# Altium project ZASS_MANTIS.PrjPcb
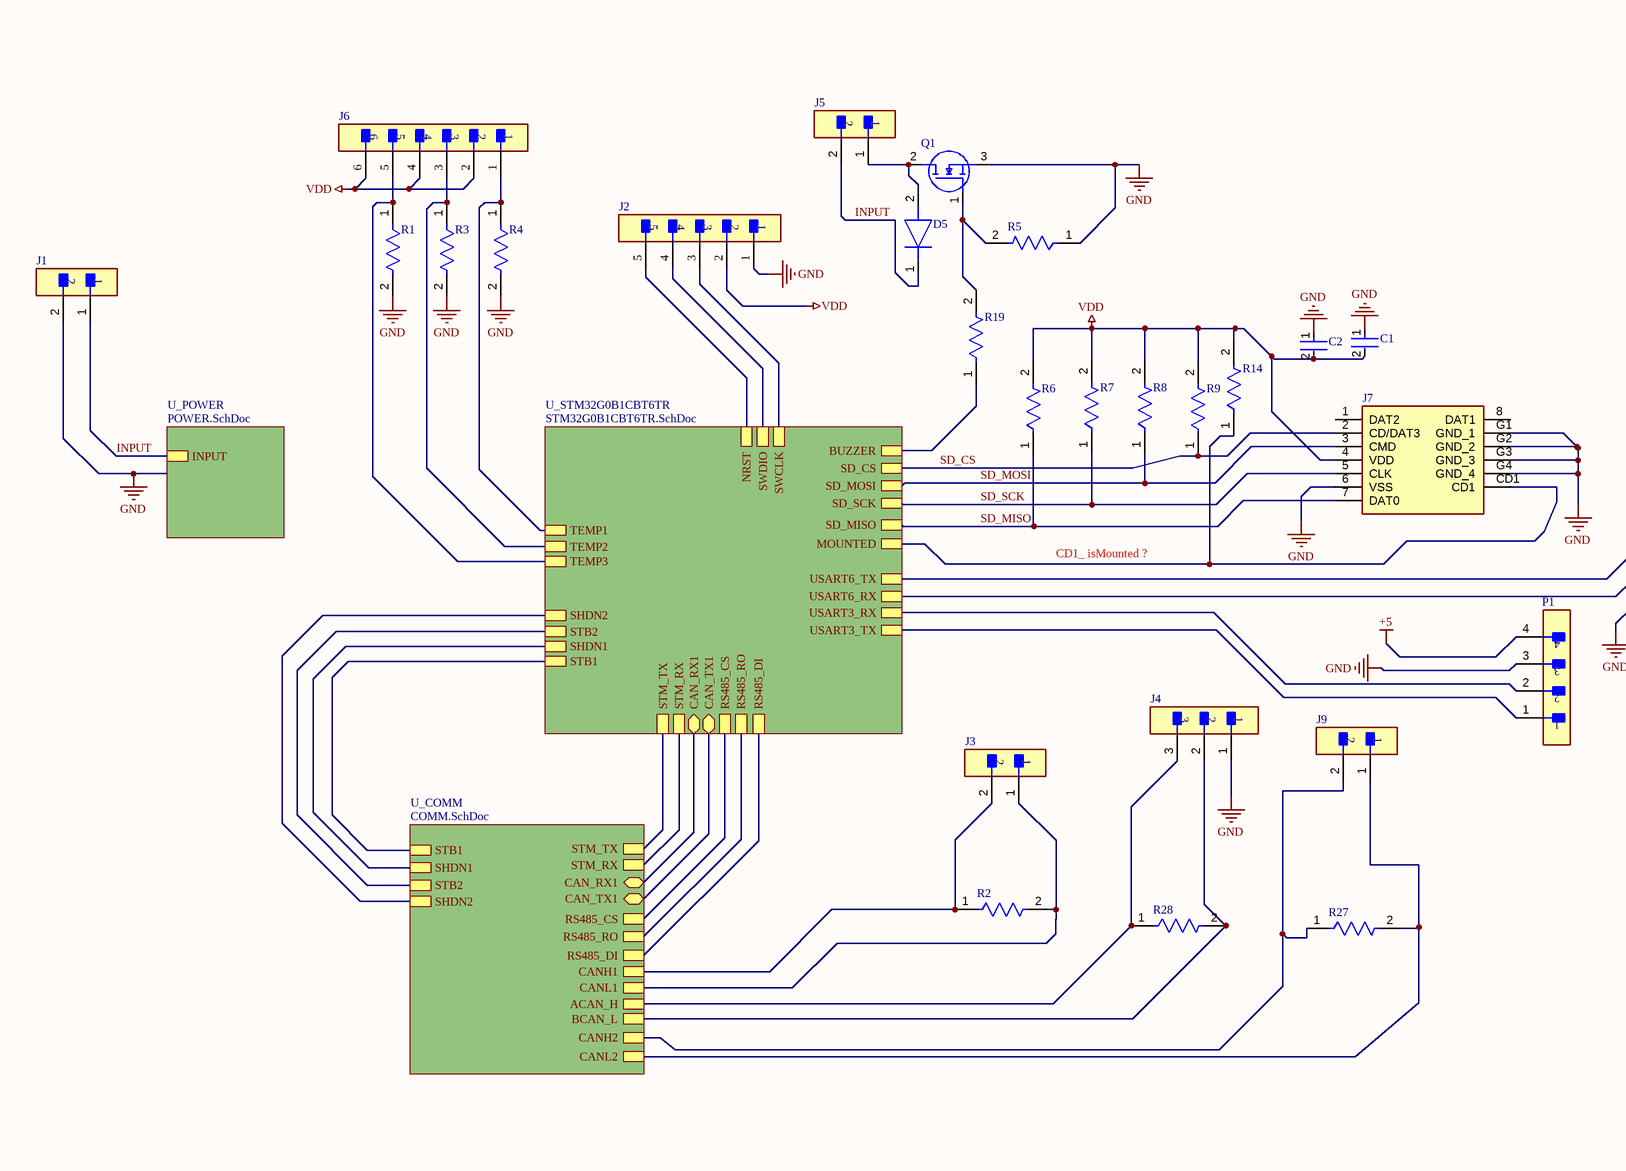
[diagram p0: MAIN.SchDoc, left]
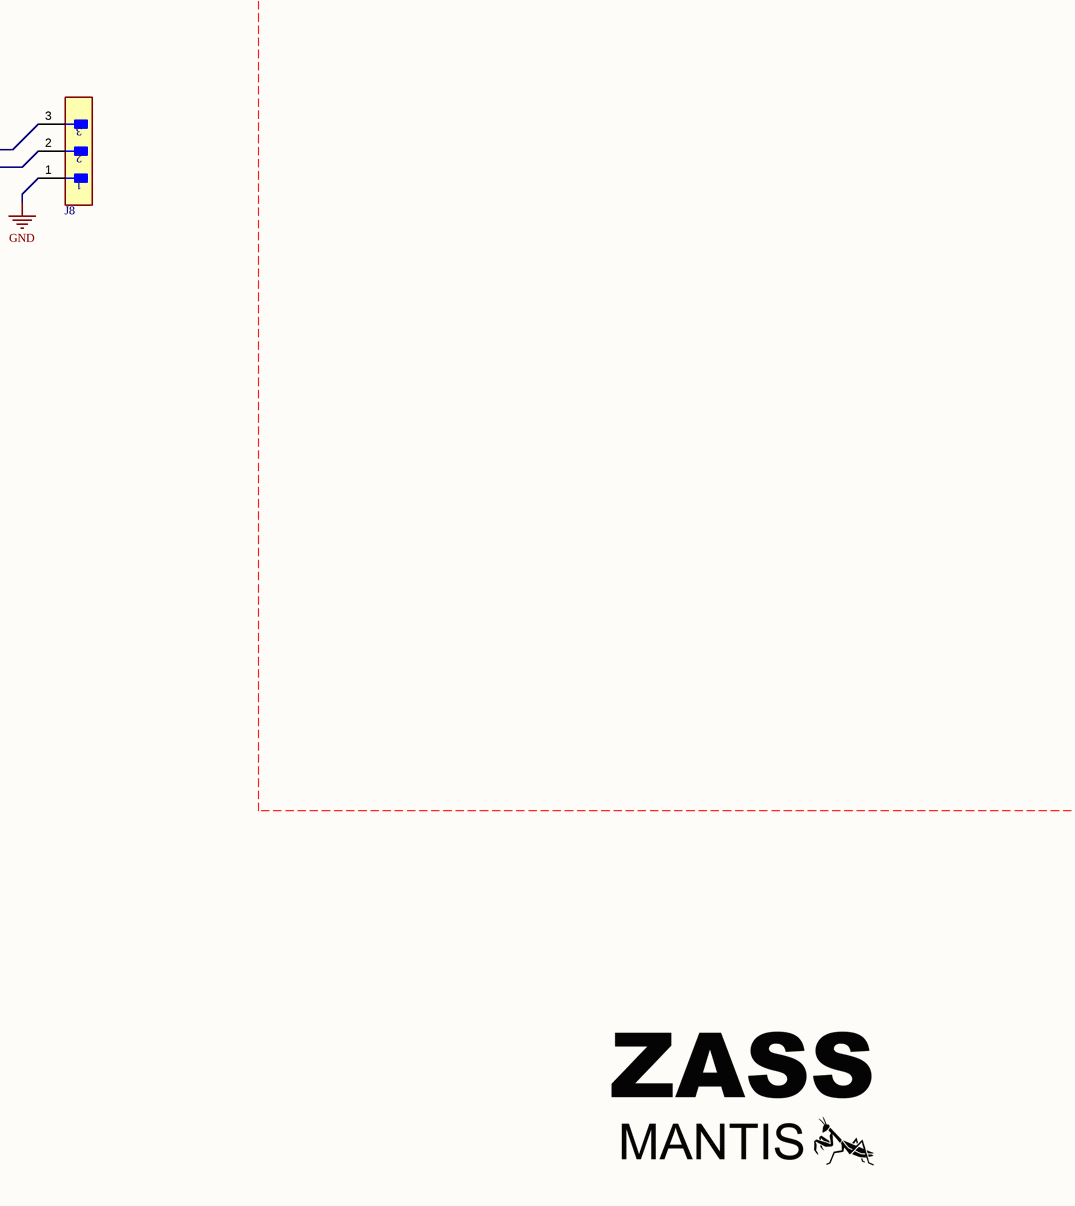
[diagram p1: MAIN.SchDoc, right]
3 sheets, 57 parts. Net scope: hierarchical (ports join the sheet entries above them; power ports are global).
Board files: PCB2.PcbDoc, PCB1.PcbDoc
Sheets:
  MAIN.SchDoc
    U_STM32G0B1CBT6TR = STM32G0B1CBT6TR.SchDoc
    U_COMM = COMM.SchDoc

## Sheet MAIN.SchDoc
size 594 x 420 mm; SheetNumber: 1; SheetTotal: 4

### Parts
C1  CC0805KRX7R5BB104  [FP-CC0805-EA-MFG]  (value not drawn)
C2  CC0805KRX7R5BB104  [FP-CC0805-EA-MFG]  (value not drawn)
D5  1N4007WS  [SOD2613X110N]  (value not drawn)
J1  B2B-XH-A(LF)(SN)  [FP-B2B-XH-A_LF_SN-MFG]  (value not drawn)
J2  B5B-XH-AM(LF)(SN)  [FP-B5B-XH-AM_LF_SN-MFG]  (value not drawn)
J3  B2B-XH-A(LF)(SN)  [FP-B2B-XH-A_LF_SN-MFG]  (value not drawn)
J4  B3B-XH-A(LF)(SN)  [FP-B3B-XH-A_LF_SN-MFG]  (value not drawn)
J5  S2B-XH-A(LF)(SN)  [FP-B2B-XH-A_LF_SN-MFG]  (value not drawn)
J6  B6B-XH-AM(LF)(SN)  [FP-B6B-XH-AM_LF_SN-MFG]  (value not drawn)
J7  MSD-4-A  [MSD4A]  (value not drawn)
J8  B3B-XH-A(LF)(SN)  [FP-B3B-XH-A_LF_SN-MFG]  (value not drawn)
J9  B2B-XH-A(LF)(SN)  [FP-B2B-XH-A_LF_SN-MFG]  (value not drawn)
P1  B4B-XH-A(LF)(SN)  [FP-B4B-XH-A_LF_SN-MFG]  (value not drawn)
Q1  AO3422  [SOT95P237X112-3N]  (value not drawn)
R1  CRGCQ0603J10K  [FP-CRGCQ0603-IPC_C]  (value not drawn)
R2  CRGCQ0603F120R  [FP-CRGCQ0603-IPC_C]  (value not drawn)
R3  CRGCQ0603J10K  [FP-CRGCQ0603-IPC_C]  (value not drawn)
R4  CRGCQ0603J10K  [FP-CRGCQ0603-IPC_C]  (value not drawn)
R5  CRGCQ0603J10K  [FP-CRGCQ0603-IPC_C]  (value not drawn)
R6  CRCW06034K70FKEA  [FP-CRCW0603-e3-IPC_A]  (value not drawn)
R7  CRCW06034K70FKEA  [FP-CRCW0603-e3-IPC_A]  (value not drawn)
R8  CRCW06034K70FKEA  [FP-CRCW0603-e3-IPC_A]  (value not drawn)
R9  CRCW06034K70FKEA  [FP-CRCW0603-e3-IPC_A]  (value not drawn)
R14  CRCW06034K70FKEA  [FP-CRCW0603-e3-IPC_A]  (value not drawn)
R19  CRGCQ0603F1K2  [FP-CRGCQ0603-IPC_C]  (value not drawn)
R27  CRGCQ0603F120R  [FP-CRGCQ0603-IPC_C]  (value not drawn)
R28  CRGCQ0603F120R  [FP-CRGCQ0603-IPC_C]  (value not drawn)

### Sub-sheets
U_COMM = COMM.SchDoc: CAN_TX1 (bidir), CAN_RX1 (bidir), ACAN_H, BCAN_L, STM_RX, STM_TX, RS485_CS, CANH1, CANL1, STB1, SHDN1, STB2, SHDN2, CANL2, CANH2, RS485_DI, RS485_RO
U_POWER = POWER.SchDoc (file not in this document): INPUT
U_STM32G0B1CBT6TR = STM32G0B1CBT6TR.SchDoc: CAN_RX1 (bidir), CAN_TX1 (bidir), STM_TX, STM_RX, USART3_RX, USART3_TX, TEMP1, TEMP2, TEMP3, SD_CS, SD_SCK, SD_MISO, SD_MOSI, BUZZER, RS485_CS, NRST, SWCLK, SWDIO, STB1, SHDN1, STB2, SHDN2, MOUNTED, RS485_DI, RS485_RO, USART6_RX, USART6_TX

### Nets
+5: P1.4
GND: C1.1 C2.1 J1.2 J2.1 J4.1 J7.6(VSS) J7.G1(GND_1) J7.G2(GND_2) J7.G3(GND_3) J7.G4(GND_4) J8.1 P1.3 Q1.3(S) R1.2 R3.2 R4.2 R5.1
VDD: C1.2 C2.2 J2.2 J6.2 J6.4 J6.6 J7.4(VDD) R6.2 R7.2 R8.2 R9.2 R14.2
INPUT: D5.1(K) J1.1 J5.2 ; sheet U_POWER/INPUT
NRST: J2.5 ; sheet U_STM32G0B1CBT6TR/NRST
SD_CS: J7.2(CD/DAT3) R9.1 ; sheet U_STM32G0B1CBT6TR/SD_CS
SD_MISO: J7.7(DAT0) R6.1 ; sheet U_STM32G0B1CBT6TR/SD_MISO
SD_MOSI: J7.3(CMD) R8.1 ; sheet U_STM32G0B1CBT6TR/SD_MOSI
SD_SCK: J7.5(CLK) R7.1 ; sheet U_STM32G0B1CBT6TR/SD_SCK
SHDN1: sheet U_STM32G0B1CBT6TR/SHDN1, sheet U_COMM/SHDN1
SHDN2: sheet U_STM32G0B1CBT6TR/SHDN2, sheet U_COMM/SHDN2
STB1: sheet U_STM32G0B1CBT6TR/STB1, sheet U_COMM/STB1
STB2: sheet U_STM32G0B1CBT6TR/STB2, sheet U_COMM/STB2
SWCLK: J2.3 ; sheet U_STM32G0B1CBT6TR/SWCLK
SWDIO: J2.4 ; sheet U_STM32G0B1CBT6TR/SWDIO
NetD2_1: J3.2 R2.1 ; sheet U_COMM/CANH1
NetD2_2: J3.1 R2.2 ; sheet U_COMM/CANL1
NetD4_1: J9.2 R27.1 ; sheet U_COMM/CANH2
NetD4_2: J9.1 R27.2 ; sheet U_COMM/CANL2
NetD5_2: D5.2(A) J5.1 Q1.2(D)
NetIC1_11: J6.1 R4.1 ; sheet U_STM32G0B1CBT6TR/TEMP1
NetIC1_12: J6.3 R3.1 ; sheet U_STM32G0B1CBT6TR/TEMP2
NetIC1_13: J6.5 R1.1 ; sheet U_STM32G0B1CBT6TR/TEMP3
NetIC1_14: J7.CD1 R14.1 ; sheet U_STM32G0B1CBT6TR/MOUNTED
NetIC1_19: sheet U_STM32G0B1CBT6TR/STM_RX, sheet U_COMM/STM_RX
NetIC1_20: sheet U_STM32G0B1CBT6TR/STM_TX, sheet U_COMM/STM_TX
NetIC1_21: R19.1 ; sheet U_STM32G0B1CBT6TR/BUZZER
NetIC1_22: P1.1 ; sheet U_STM32G0B1CBT6TR/USART3_TX
NetIC1_23: P1.2 ; sheet U_STM32G0B1CBT6TR/USART3_RX
NetIC1_29: sheet U_STM32G0B1CBT6TR/RS485_CS, sheet U_COMM/RS485_CS
NetIC1_33: sheet U_STM32G0B1CBT6TR/CAN_RX1, sheet U_COMM/CAN_RX1
NetIC1_34: sheet U_STM32G0B1CBT6TR/CAN_TX1, sheet U_COMM/CAN_TX1
NetIC1_40: sheet U_STM32G0B1CBT6TR/RS485_DI, sheet U_COMM/RS485_DI
NetIC1_41: sheet U_STM32G0B1CBT6TR/RS485_RO, sheet U_COMM/RS485_RO
NetIC1_47: J8.2 ; sheet U_STM32G0B1CBT6TR/USART6_RX
NetIC1_48: J8.3 ; sheet U_STM32G0B1CBT6TR/USART6_TX
NetJ4_2: J4.2 R28.2 ; sheet U_COMM/BCAN_L
NetJ4_3: J4.3 R28.1 ; sheet U_COMM/ACAN_H
NetQ1_1: Q1.1(G) R5.2 R19.2

Not connected (* = marked no-connect by the designer): J7 1(DAT2) 8(DAT1)

### Notes on the sheet
- CD1_ isMounted ?
- DWG NO:
- REV:
- THIS DOCUMENT AND THE DATA DISCLOSED HEREIN OR
- HEREWITH IS THE PROPERTY OF ALTIUM LIMITED AND MAY
- BE FREELY DISTRIBUTED IN WHOLE. NO RIGHTS ARE
- RESERVED OR EXPRESS OR IMPLIED WARANTEE GIVEN.
- REVISION
- DESCRIPTION
- DATE
- APPROVED
- PROJECT
- PROJECT REVISION:
- TITLE
- A2
- SIZE
- FILE NAME
- SHEET
- OF

### Library data of the parts
C1 C2 = CMP-03422-000810-2: CAP CER X7R 0805; RoHS Compliant: Yes
D5 = 1N4007WS: Diode; Manufacturer_Name: MDD; Datasheet Link: https://datasheet.lcsc.com/szlcsc/MDD-Jiangsu-Yutai-Elec-1N4007WS_C193404.pdf; Height: 1.1mm; Manufacturer_Part_Number: 1N4007WS
J1 J3 J5 J9 = CMP-2000-05888-3: CONN HEADER VERT 2POS 2.5MM; Current Rating: 3A; Voltage Rating: 250V; Number of Contacts: 2; Contact Resistance: 20mR; Wire/Cable Gauge: 22AWG; Insulation Resistance: 1GR; Connector Type: Male Pin; Packaging: Bulk; Contact Material: Brass; Lead Free: Lead Free; Orientation: Straight; Contact Plating: Tin; Max Current Rating: 3A; Termination: Solder; Fastening Type: Detent; Depth: 5.75mm; Housing Material: Polyamide; REACH SVHC: No SVHC; Series: XH; Voltage Rating (AC): 250V; Number of Positions: 2; Color: Natural; Contact Type: Male Pin; Max Voltage Rating (DC): 250V; Pitch: 2.5mm; Lead Pitch: 2.5mm; Mount: Through Hole; Max Operating Temperature: 85°C; Length: 7.4mm; Max Voltage Rating (AC): 250V; Min Operating Temperature: -25°C; Number of Rows: 1; Housing Color: White
J2 = CMP-17439-000304-1: CONN HEADER VERT 5POS 2.5MM; Mated Stacking Heights: 9.8mm; Voltage Rating: 250V; Max Current Rating: 3A; Number of Positions: 5; Contact Resistance: 20mR; Depth: 5.75mm; Connector Type: Header; Color: Green; Insulation Material: Nylon; Contact Plating: Copper; Length: 14.9mm; Fastening Type: Detent; Contact Material: Brass; Number of Rows: 1; Contact Type: Male Pin; Housing Material: Polyamide; Housing Color: White; Lead Free: Lead Free; Max Voltage Rating (AC): 250V; Mount: Through Hole; Contact Shape: Square; Min Operating Temperature: -25°C; Packaging: Bulk; Orientation: Straight; Insulation Color: Natural; Series: XH; Flammability Rating: UL94 V-0; Contact Finish - Mating: TIN; Max Operating Temperature: 85°C; Termination: Solder; Pitch: 2.5mm
J4 J8 = CMP-17439-000014-3: CONN HEADER VERT 3POS 2.5MM; Max Voltage Rating (DC): 250V; Number of Positions: 3; Current Rating: 3A; Gender: Male; Wire/Cable Gauge: 22AWG; Contact Resistance: 20mR; Insulation Resistance: 1GR; Insulation Material: Nylon; Contact Plating: Tin; Depth: 5.75mm; Contact Type: Male Pin; Max Operating Temperature: 85°C; Insulation Color: Natural; Voltage Rating (AC): 250V; Color: Natural; Connector Type: Header; Orientation: Straight; Fastening Type: Detent; Housing Color: White; Min Operating Temperature: -25°C; Termination: Solder; Voltage Rating: 250V; Series: XH; Pitch: 2.5mm; Contact Shape: Square; Number of Rows: 1; Lead Free: Lead Free; Packaging: Bulk; Mount: Through Hole; Flammability Rating: UL94 V-0; Max Voltage Rating (AC): 250V; REACH SVHC: No SVHC; Housing Material: Polyamide; Contact Material: Brass; Lead Pitch: 2.5mm; Contact Finish - Mating: TIN; Length: 9.9mm; Max Current Rating: 3A; Number of Contacts: 3
J6 = CMP-17439-000167-1: CONN HEADER VERT 6POS 2.5MM; Shape: Straight; Current Rating: 3A; Mated Stacking Heights: 9.8mm; Number of Positions: 6; Voltage Rating: 250V; Pitch: 2.5mm; Insulation Color: Natural; Number of Pins: 6; Width: 5.75mm; Flammability Rating: UL94 V-0; Packaging: Bulk; Connector Type: Header; Number of Rows: 1; Contact Plating: Copper; Mount: Through Hole; Min Operating Temperature: -25°C; Contact Type: Male Pin; Contact Shape: Square; Fastening Type: Detent; Length: 17.4mm; Series: XH; Contact Finish - Mating: TIN; Max Operating Temperature: 85°C; Insulation Material: Nylon; Number of Poles: 6; Termination: Press-Fit; Contact Material: Brass; Height: 7mm
J7 = MSD-4-A: Connector; Manufacturer_Name: Same Sky; Datasheet Link: https://www.sameskydevices.com/product/resource/MSD-4-A.pdf; Height: 2mm; Manufacturer_Part_Number: MSD-4-A; Mouser Part Number: 179-MSD-4-A; Mouser Price/Stock: https://www.mouser.co.uk/ProductDetail/Same-Sky/MSD-4-A?qs=Z%252BL2brAPG1Jll%252BQTi%252Btupg%3D%3D; Arrow Part Number: MSD-4-A; Arrow Price/Stock: https://www.arrow.com/en/products/msd-4-a/cui-devices?utm_currency=USD&region=nac
P1 = CMP-17439-000250-1: CONN HEADER VERT 4POS 2.5MM; Number of Contacts: 4; Contact Resistance: 20mR; Voltage Rating: 250V; Max Current Rating: 3A; Gender: Male; Wire/Cable Gauge: 22AWG; Mated Stacking Heights: 9.8mm; Insulation Resistance: 1GR; Orientation: Straight; Contact Type: Male Pin; Contact Finish - Mating: TIN; Series: XH; Max Voltage Rating (AC): 250V; Lead Pitch: 2.5mm; Contact Shape: Square; Insulation Color: Natural; Termination: Solder; Lead Free: Lead Free; Voltage Rating (AC): 250V; Number of Rows: 1; Flammability Rating: UL94 V-0; Number of Positions: 4; Max Operating Temperature: 85°C; Package Quantity: 500; Mount: Through Hole; REACH SVHC: No SVHC; Connector Type: Header; Insulation Material: Nylon; Fastening Type: Detent; Min Operating Temperature: -25°C; Housing Color: White; Packaging: Bulk; Contact Plating: Tin; Contact Material: Brass; Max Voltage Rating (DC): 250V; Housing Material: Polyamide; Color: Natural; Material: Polyamide; Pitch: 2.5mm; Depth: 5.75mm; Current Rating: 3A; Length: 12.4mm
Q1 = AO3422: MOSFET (N-Channel); Manufacturer_Name: Alpha & Omega Semiconductors; Datasheet Link: http://aosmd.com/res/data_sheets/AO3422.pdf; Height: 1.12mm; Manufacturer_Part_Number: AO3422; Arrow Part Number: AO3422; Arrow Price/Stock: https://www.arrow.com/en/products/ao3422/alpha-and-omega-semiconductor?region=nac
R1 R3-R5 = CMP-03211-009884-1: CRGCQ 0603 10K 5%; Manufacturer: TE Connectivity; Tolerance: 0.05; Power Rating: 0.1W; Resistance: 10KΩ; Voltage Rating: 75V; Value: 10KΩ; Temperature Coefficient: ±100ppm/°C; Composition: Thick Film; ComponentLink2URL: https://www.te.com/commerce/DocumentDelivery/DDEController?Action=showdoc&DocId=Data+Sheet%7F1773204-3%7F1%7Fpdf%7FEnglish%7FENG_DS_1773204-3_1.pdf%7F4-2176339-923; Device Class L1: Passive Components; Package: CRGCQ0603; Mouser Description: Res Thick Film 0603 10K Ohm 5% 0.1W(1/10W) ±100ppm/C Pad SMD Automotive T/R; Temperature Range High: +155°C; Category: Res; Device Class L2: Resistors; Height: 0.55mm; RoHS: TRUE; Lead Free: Yes; Ipc Land Pattern Name: RESC16080X45; Temperature: -55°C to +155°C; Series: CRGCQ; Digikey Description: CRGCQ 0603 10K 5%; Octopart: https://octopart.com/crgcq0603j10k-te+connectivity-91018097; Device Class L3: Chip SMD Resistors; Ambient Temperature Range High: +70°C; ComponentLink2Description: Datasheet; Temperature Range Low: -55°C; Manufacturer Part Number: CRGCQ0603J10K
R2 R27 R28 = CMP-03211-001601-1: CRGCQ0603 120Ω 1% ±100ppm/°C 75V; Manufacturer: TE Connectivity; Tolerance: 0.01; Power Rating: 0.1W; Voltage Rating: 75V; Device Class L2: Resistors; Ambient Temperature Range High: +70°C; Mouser Description: Res, Aec-Q200, Thick Film, 120R, 1%, 0603; Composition: Thick Film; Device Class L1: Passive Components; Temperature Range Low: -55°C; Manufacturer Part Number: CRGCQ0603F120R; Lead Free: Yes; Value: 120Ω; ComponentLink2Description: Datasheet; Device Class L3: Chip SMD Resistors; Package: CRGCQ0603; Ipc Land Pattern Name: RESC16080X45; Height: 0.55mm; Category: Res; RoHS: TRUE; Temperature Range High: +155°C; Resistance: 120Ω; Octopart: https://octopart.com/crgcq0603f120r-te+connectivity-91018039; Temperature Coefficient: ±100ppm/°C; ComponentLink2URL: https://www.te.com/commerce/DocumentDelivery/DDEController?Action=showdoc&DocId=Data+Sheet%7F1773204-3%7F1%7Fpdf%7FEnglish%7FENG_DS_1773204-3_1.pdf%7F4-2176339-482; Temperature: -55°C to +155°C; Series: CRGCQ
R6-R9 R14 = CMP-1666-00019-3: RES Thick Film, 4.7kΩ, 1%, 0.1W, 100ppm/°C, 0603; Resistance: 4.7kR; Voltage Rating: 75V; Power Rating: 100mW; Case Code (Metric): 1608; Military Standard: Not; Packaging: Tape and Reel; Termination: SMD/SMT; Temperature Coefficient: 100ppm/°C; Lead Free: Lead Free; Length: 1.55mm; Width: 0.85mm; Height: 0.45mm; Depth: 0.85mm; Weight: 7.1E-05oz; Case Code (Imperial): 0603; Contact Plating: Tin; Case/Package: 0603; Max Operating Temperature: 155°C; Mount: Surface Mount; Tolerance: 1%; Min Operating Temperature: -55°C; Package Quantity: 5000; Voltage Rating (DC): 75V; Composition: Thick Film
R19 = CMP-03211-000516-1: CRGCQ 0603 1K2 1%; Manufacturer: TE Connectivity; Power Rating: 0.1W; Resistance: 1.2KΩ; Value: 1.2KΩ; Voltage Rating: 75V; Temperature Coefficient: ±100ppm/°C; Tolerance: 0.01; Octopart: https://octopart.com/crgcq0603f1k2-te+connectivity-91018051; ComponentLink2Description: Datasheet; ComponentLink2URL: https://www.te.com/commerce/DocumentDelivery/DDEController?Action=showdoc&DocId=Data+Sheet%7F1773204-3%7F1%7Fpdf%7FEnglish%7FENG_DS_1773204-3_1.pdf%7F4-2176339-710; Category: Res; Temperature: -55°C to +155°C; Temperature Range High: +155°C; Ipc Land Pattern Name: RESC16080X45; Device Class L2: Resistors; Height: 0.55mm; Ambient Temperature Range High: +70°C; RoHS: TRUE; Package: CRGCQ0603; Temperature Range Low: -55°C; Digikey Description: CRGCQ 0603 1K2 1%; Series: CRGCQ; Lead Free: Yes; Manufacturer Part Number: CRGCQ0603F1K2; Device Class L1: Passive Components; Composition: Thick Film; Device Class L3: Chip SMD Resistors

## Sheet STM32G0B1CBT6TR.SchDoc
size 594 x 420 mm; SheetNumber: 2; SheetTotal: 4
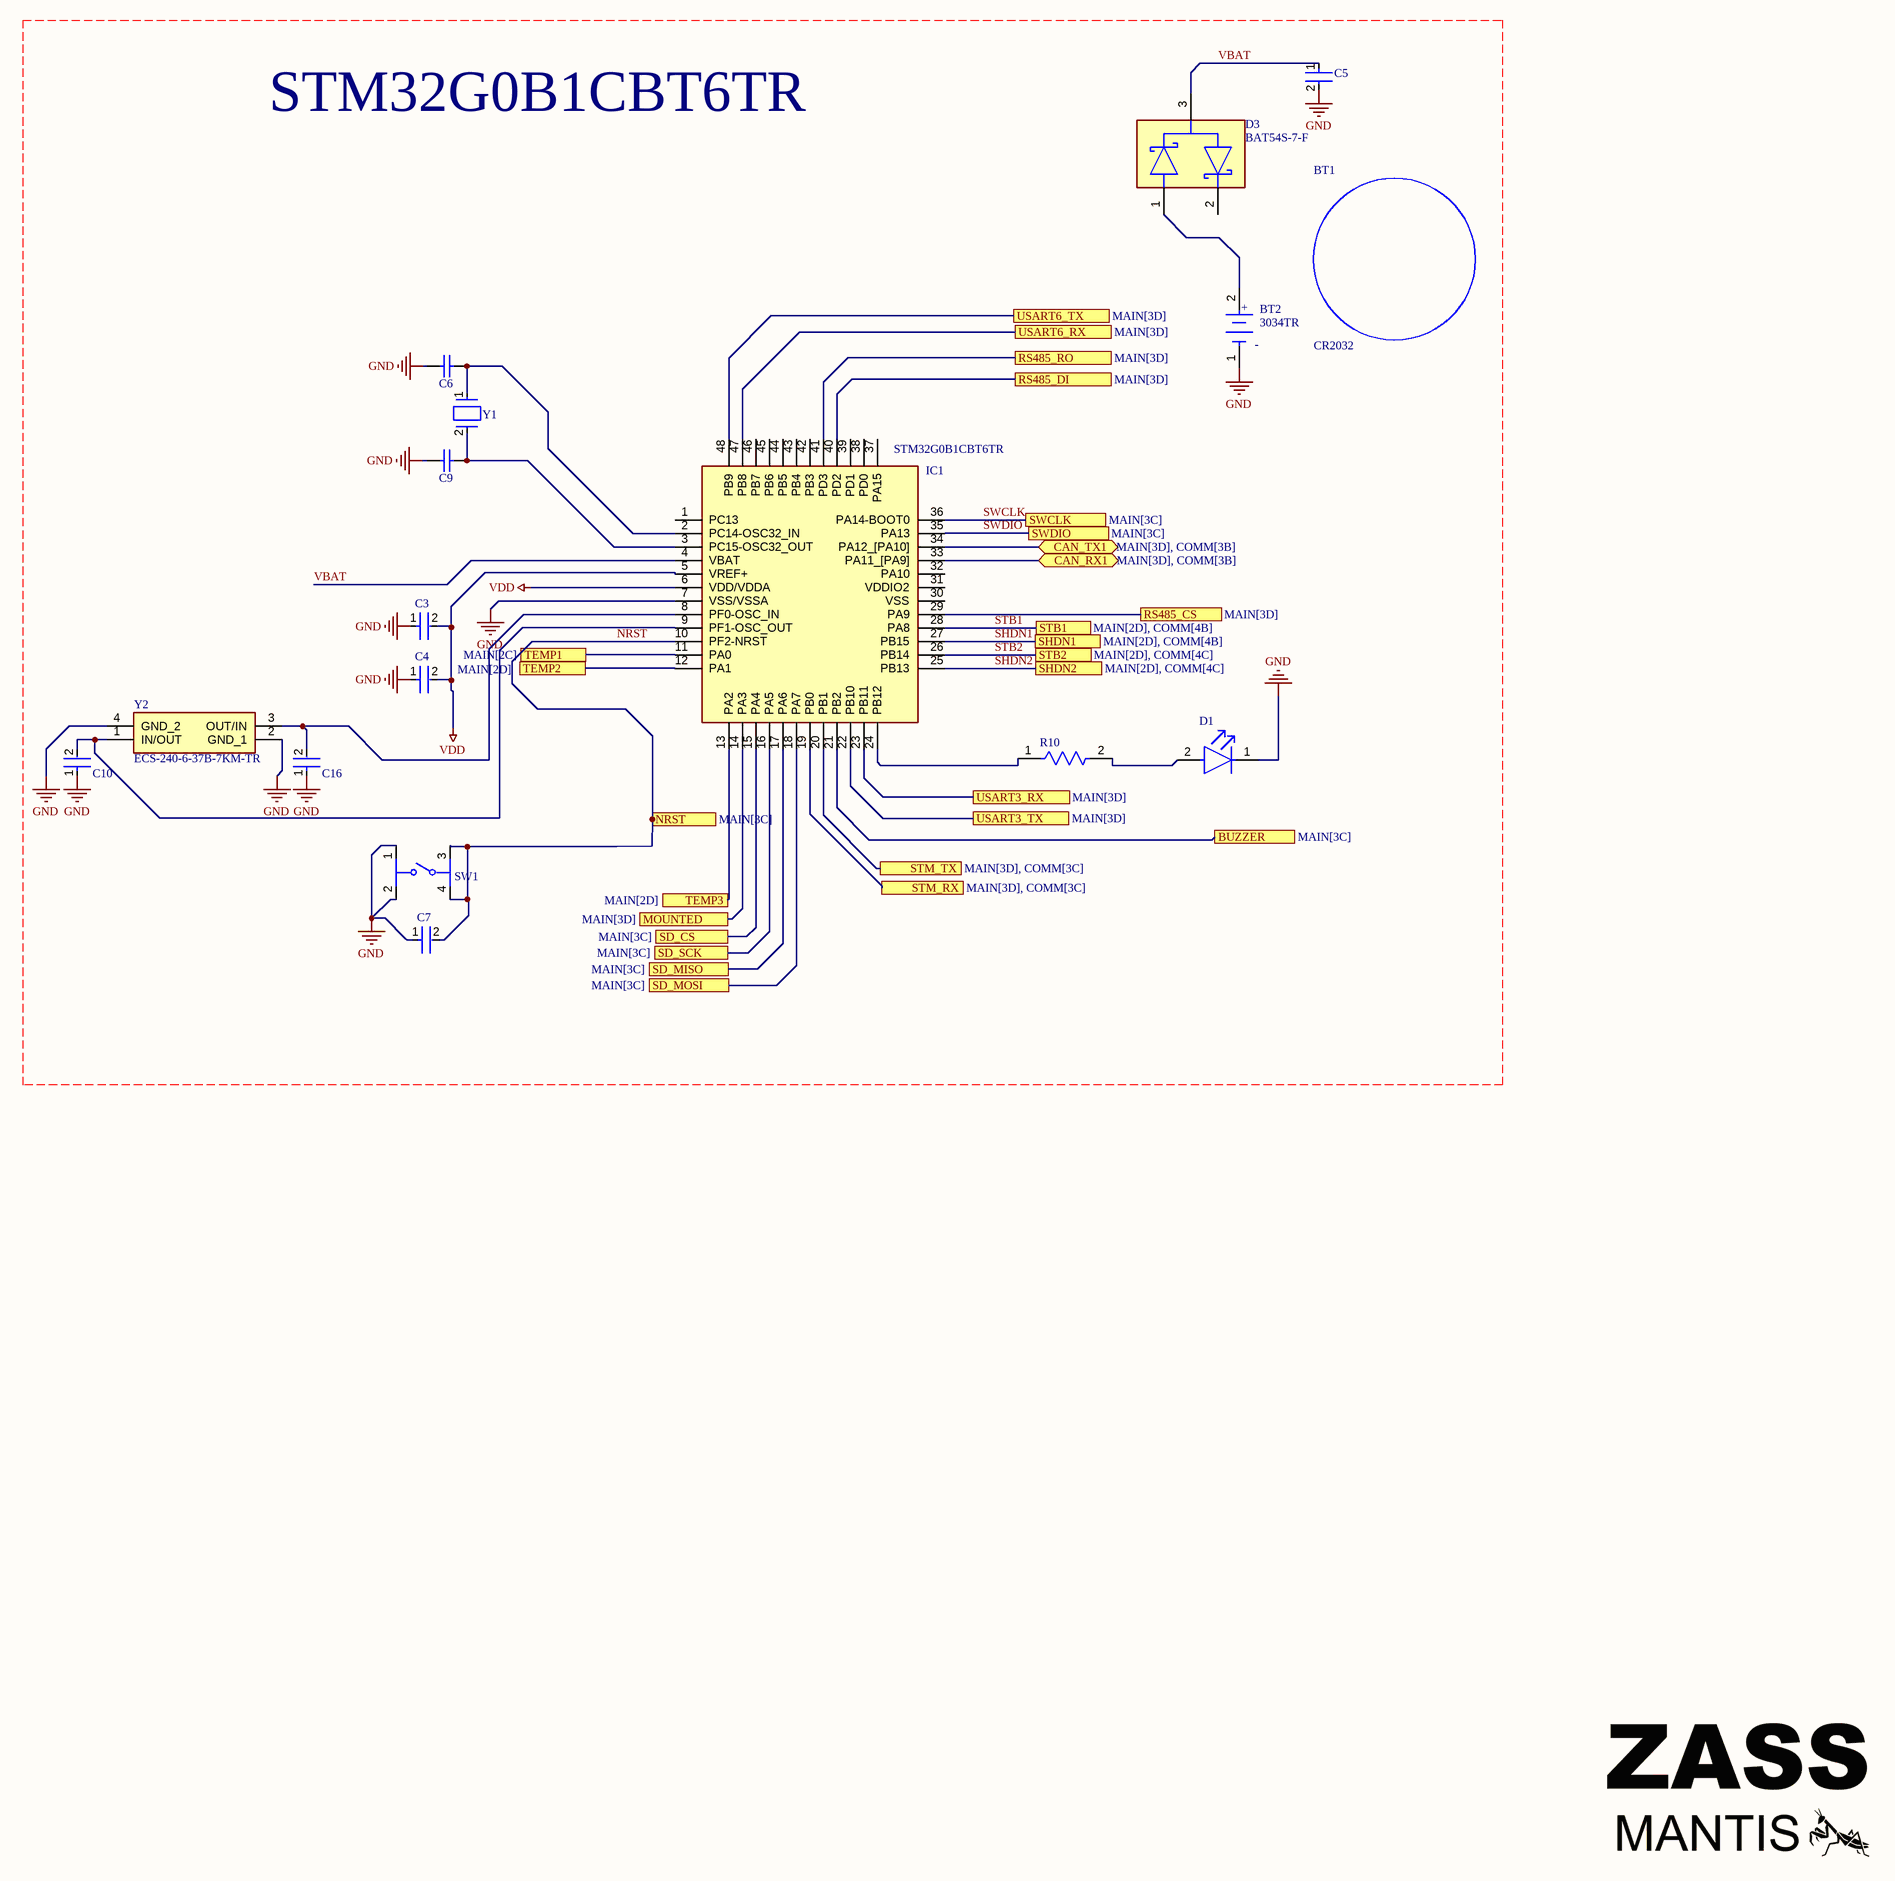
[diagram p2: STM32G0B1CBT6TR.SchDoc]

### Parts
(Parts that share a designator on the sheet are numbered #1, #2 ... from top to bottom, then left to right.)
BT1  CR2032  [FP-CR2032-MFG]
BT2  3034TR  [FP-3034TR-MFG]
C3  C0805C104K5RACTU  [FP-C0805C-DN-MFG]  (value not drawn)
C4  C0805C104K5RACTU  [FP-C0805C-DN-MFG]  (value not drawn)
C5  CC0805KRX7R5BB104  [FP-CC0805-EA-MFG]  (value not drawn)
C6  06035A220KAT2A  [CAPC1608X90X35ML15T15]  (value not drawn)
C7  C0805C104K5RACTU  [FP-C0805C-DN-MFG]  (value not drawn)
C9#1  06035A220KAT2A  [CAPC1608X90X35ML15T15]  (value not drawn)
C10  C0805C519D3HACTU  [FP-C0805C-DN-MFG]  (value not drawn)
C16  C0805C519D3HACTU  [FP-C0805C-DN-MFG]  (value not drawn)
D1  LTST-C230EKT  [FP-LTST-C230EKT-MFG]  (value not drawn)
D3#1  BAT54S-7-F  [FP-SOT23-MFG]
IC1  STM32G0B1CBT6TR  [QFP50P900X900X160-48N]
R10  CRGCQ1206F1K0  [FP-CRGCQ1206-IPC_C]  (value not drawn)
SW1  PTS647SK38SMTR2LFS  [FP-PTS647SK38SMTR2LFS-MFG]  (value not drawn)
Y1  ECX-.327-CDX-1293  [FP-ECS-CDX-MFG]  (value not drawn)
Y2  ECS-240-6-37B-7KM-TR  [ECS240637B7KMTR]

### Ports
BUZZER (see MAIN[3C]), CAN_RX1 (bidir, see MAIN[3D], COMM[3B]), CAN_TX1 (bidir, see MAIN[3D], COMM[3B]), MOUNTED (see MAIN[3D]), NRST (see MAIN[3C]), RS485_CS (see MAIN[3D]), RS485_DI (see MAIN[3D]), RS485_RO (see MAIN[3D]), SD_CS (see MAIN[3C]), SD_MISO (see MAIN[3C]), SD_MOSI (see MAIN[3C]), SD_SCK (see MAIN[3C]), SHDN1 (see MAIN[2D], COMM[4B]), SHDN2 (see MAIN[2D], COMM[4C]), STB1 (see MAIN[2D], COMM[4B]), STB2 (see MAIN[2D], COMM[4C]), STM_RX (see MAIN[3D], COMM[3C]), STM_TX (see MAIN[3D], COMM[3C]), SWCLK (see MAIN[3C]), SWDIO (see MAIN[3C]), TEMP1 (see MAIN[2C]), TEMP2 (see MAIN[2D]), TEMP3 (see MAIN[2D]), USART3_RX (see MAIN[3D]), USART3_TX (see MAIN[3D]), USART6_RX (see MAIN[3D]), USART6_TX (see MAIN[3D])

### Nets
GND: BT2.1(C) C3.1 C4.1 C5.2 C6.1 C7.1 C9#1.1 C10.1 C16.1 D1.1(C) IC1.7(VSS/VSSA) SW1.1 SW1.2 Y2.2(GND_1) Y2.4(GND_2)
VDD: C3.2 C4.2 IC1.5(VREF+) IC1.6(VDD/VDDA)
NRST: C7.2 IC1.10(PF2-NRST) SW1.3 SW1.4 ; port NRST
SD_CS: IC1.15(PA4) ; port SD_CS
SD_MISO: IC1.17(PA6) ; port SD_MISO
SD_MOSI: IC1.18(PA7) ; port SD_MOSI
SD_SCK: IC1.16(PA5) ; port SD_SCK
SHDN1: IC1.27(PB15) ; port SHDN1
SHDN2: IC1.25(PB13) ; port SHDN2
STB1: IC1.28(PA8) ; port STB1
STB2: IC1.26(PB14) ; port STB2
SWCLK: IC1.36(PA14-BOOT0) ; port SWCLK
SWDIO: IC1.35(PA13) ; port SWDIO
VBAT: C5.1 D3#1.3 IC1.4(VBAT)
NetBT2_2: BT2.2(A) D3#1.1
NetC6_2: C6.2 IC1.2(PC14-OSC32_IN) Y1.1(In/Out)
NetC9#1_2: C9#1.2 IC1.3(PC15-OSC32_OUT) Y1.2(Out/In)
NetC10_2: C10.2 IC1.9(PF1-OSC_OUT) Y2.1(IN/OUT)
NetC16_2: C16.2 IC1.8(PF0-OSC_IN) Y2.3(OUT/IN)
NetD1_2: D1.2(A) R10.2
NetIC1_11: IC1.11(PA0) ; port TEMP1
NetIC1_12: IC1.12(PA1) ; port TEMP2
NetIC1_13: IC1.13(PA2) ; port TEMP3
NetIC1_14: IC1.14(PA3) ; port MOUNTED
NetIC1_19: IC1.19(PB0) ; port STM_RX
NetIC1_20: IC1.20(PB1) ; port STM_TX
NetIC1_21: IC1.21(PB2) ; port BUZZER
NetIC1_22: IC1.22(PB10) ; port USART3_TX
NetIC1_23: IC1.23(PB11) ; port USART3_RX
NetIC1_24: IC1.24(PB12) R10.1
NetIC1_29: IC1.29(PA9) ; port RS485_CS
NetIC1_33: IC1.33(PA11_[PA9]) ; port CAN_RX1
NetIC1_34: IC1.34(PA12_[PA10]) ; port CAN_TX1
NetIC1_40: IC1.40(PD2) ; port RS485_DI
NetIC1_41: IC1.41(PD3) ; port RS485_RO
NetIC1_47: IC1.47(PB8) ; port USART6_RX
NetIC1_48: IC1.48(PB9) ; port USART6_TX

Not connected (* = marked no-connect by the designer): D3#1 2; IC1 1(PC13) 30(VSS) 31(VDDIO2) 32(PA10) 37(PA15) 38(PD0) 39(PD1) 42(PB3) 43(PB4) 44(PB5) 45(PB6) 46(PB7)

### Notes on the sheet
- STM32G0B1CBT6TR
- DWG NO:
- REV:
- THIS DOCUMENT AND THE DATA DISCLOSED HEREIN OR
- HEREWITH IS THE PROPERTY OF ALTIUM LIMITED AND MAY
- BE FREELY DISTRIBUTED IN WHOLE. NO RIGHTS ARE
- RESERVED OR EXPRESS OR IMPLIED WARANTEE GIVEN.
- REVISION
- DESCRIPTION
- DATE
- APPROVED
- PROJECT
- PROJECT REVISION:
- TITLE
- A2
- SIZE
- FILE NAME
- SHEET
- OF
- (in symbol CMP-19636-000007-1) +; -

### Library data of the parts
BT1 = CMP-05417-000003-1: BATTERY LITHIUM 3V COIN 20MM; Manufacturer: Panasonic; ComponentLink2URL: https://upverter.com/datasheet/5ee6469450a36cf26ddc1e0271adf06b3d83bec7.pdf; Device Class L3: unset; Device Class L1: Passive Components; Temperature Range Low: -30°C; Package: CR2032; Mouser Description: Battery; Lithium High Energy; 3 VoltS; 230 MAH; Coin Cell; ComponentLink2Description: Datasheet; Device Class L2: unset; Manufacturer Part Number: CR2032; Octopart: https://octopart.com/cr2032-panasonic-39385932; Temperature Range High: +60°C; Temperature: -30°C to +60°C; Automotive: No; Category: Batt; Height: 3.2mm
BT2 = CMP-19636-000007-1: BATTERY RETAINER COIN 20MM SMD; Number of Batteries: 1; Lead Free: Lead Free; Mount: Surface Mount; Number of Cells: 1; Termination: SMD/SMT; Package Quantity: 500; Packaging: Tape and Reel; Contact Plating: Tin; Case/Package: SMD/SMT; Material: Bronze
C3 C4 C7 = CMP-2007-00279-2: CAP CER 0.1UF 50V X7R 0805; Manufacturer: KEMET; Value: 0.10 μF; Tolerance: 0.1; Temperature Coefficient: 30ppm/°C; Material: Ceramic; Manufacturer Part Number: C0805C104K5RACTU; Device Class L2: Capacitors; Temperature Range Low: -55°C; Voltage Rating: 50 V; Digikey Description: CAP CER 0.1UF 50V X7R 0805; Category: Cap; ComponentLink2Description: Datasheet; Octopart: https://octopart.com/c0805c104k5ractu-kemet-143926; RoHS: TRUE; ComponentLink2URL: https://content.kemet.com/datasheets/KEM_C1003_C0G_SMD.pdf; Temperature Characteristic: X7R; Temperature: -55°C to +125°C; Height: 0.88mm; Temperature Range High: +125°C; Device Class L1: Passive Components; Automotive: No; Lead Free: Yes; Ipc Land Pattern Name: CAPC200125X78; Device Class L3: Ceramic Capacitors; Mouser Description: Cap Ceramic 0.1uF 50V X7R 10% SMD 2.0 x 1.2 mm 125 C Paper T/R; Capacitance: 0.10 μF; Package: C0805C-DN
C5 = CMP-03422-000810-2: CAP CER X7R 0805; RoHS Compliant: Yes
C6 C9#1 = CMP-2006-04272-1: Manufacturer: AVX Interconnect / Elco; Part Number: 06035A220KAT2A
C10 C16 = CMP-03020-033346-1: C0805 5.1 pF X8R 30ppm/°C 0.5 pF 25 V; Manufacturer: KEMET; Voltage Rating: 25 V; Tolerance: 0.5 pF; Capacitance: 5.1 pF; Value: 5.1 pF; Material: Ceramic; Category: Cap; Lead Free: Yes; Temperature Characteristic: X8R; Manufacturer Part Number: C0805C519D3HACTU; Ipc Land Pattern Name: CAPC200125X78; ComponentLink2Description: Datasheet; Package: C0805C-DN; Device Class L2: Capacitors; Automotive: No; Octopart: https://octopart.com/c0805c519d3hactu-kemet-88727353; Device Class L1: Passive Components; Temperature Coefficient: 30ppm/°C; Temperature Range High: +125°C; Height: 0.88mm; Temperature Range Low: -55°C; ComponentLink2URL: https://content.kemet.com/datasheets/KEM_C1003_C0G_SMD.pdf; Device Class L3: Ceramic Capacitors; RoHS: TRUE; Temperature: -55°C to +125°C
D1 = CMP-22017-000030-1: LED RED CLEAR CHIP SMD; Forward Current: 30mA; Test Current: 10mA; Number of Elements: 1; Viewing Angle: 130°; Dominant Wavelength: 621nm; Forward Voltage: 2V; Lens Style: Diffused; Power Rating: 100mW; Reverse Voltage: 5V; Wavelength: 630nm; Luminous Intensity: 6mcd; Lens Color: Colorless; Case/Package: 1206; Case Code (Imperial): 1206; Package Quantity: 1; Lead Free: Lead Free; Case Code (Metric): 3216; Height: 1.1mm; Lens Transparency: Clear; Mount: Surface Mount; Depth: 1.6mm; Number of LEDs: 1; Power Dissipation: 100mW; Max Operating Temperature: 85°C; Width: 1.6mm; Color: Red; Number of Pins: 2; Min Operating Temperature: -55°C; Packaging: Tape and Reel; Radiation Hardening: No; Illumination Color: Red; Length: 3.2mm
D3#1 = CMP-1667-00006-2: DIODE ARRAY SCHOTTKY 30V SOT23-3; Forward Voltage: 800mV; Reverse Recovery Time: 5ns; Peak Non-Repetitive Surge Current: 600mA; Power Rating: 200mW; Current Rating: 200mA; Peak Reverse Current: 2uA; Capacitance: 10pF; Width: 1.3mm; Mount: Surface Mount; Height: 1mm; Number of Pins: 3; Weight: 0.000282oz; Max Reverse Voltage (DC): 30V; Max Power Dissipation: 200mW; Lead Free: Lead Free; Max Operating Temperature: 150°C; Min Operating Temperature: -65°C; Package Quantity: 3000; REACH SVHC: No SVHC; Termination: SMD/SMT; Max Forward Surge Current (Ifsm): 600mA; Radiation Hardening: No; Voltage Rating (DC): 30V; Average Rectified Current: 200mA; Max Repetitive Reverse Voltage (Vrrm): 30V; Contact Plating: Tin; Case/Package: SOT-23; Forward Current: 200mA; Power Dissipation: 200mW; Length: 2.9mm; Packaging: Tape and Reel
IC1 = STM32G0B1CBT6TR: Integrated Circuit; Manufacturer_Name: STMicroelectronics; Datasheet Link: https://www.st.com/resource/en/datasheet/stm32g0b1cc.pdf; Height: 1.6mm; Manufacturer_Part_Number: STM32G0B1CBT6TR; Mouser Part Number: 511-STM32G0B1CBT6TR; Mouser Price/Stock: https://www.mouser.co.uk/ProductDetail/STMicroelectronics/STM32G0B1CBT6TR?qs=HoCaDK9Nz5cqFCA6TLpp%252Bw%3D%3D; Arrow Part Number: STM32G0B1CBT6TR; Arrow Price/Stock: https://www.arrow.com/en/products/stm32g0b1cbt6tr/stmicroelectronics?utm_currency=USD&region=nac
R10 = CMP-03211-006592-1: CRGCQ1206 1KΩ 0.25W 1% ±100ppm/°C 200V; Manufacturer: TE Connectivity; Automotive Grade: Grade 685; Tolerance: 0.01; Ipc Land Pattern Name: RESC310155X55; Temperature Range Low: -55°C; Device Class L3: Chip SMD Resistors; ComponentLink2URL: https://www.te.com/commerce/DocumentDelivery/DDEController?Action=showdoc&DocId=Data+Sheet%7F1773204-3%7F1%7Fpdf%7FEnglish%7FENG_DS_1773204-3_1.pdf%7F4-2176347-694; Automotive: Yes; Temperature: -55°C to +155°C; Manufacturer Part Number: CRGCQ1206F1K0; Package: CRGCQ1206; Octopart: https://octopart.com/crgcq1206f1k0-te+connectivity-91018258; Device Class L1: Passive Components; Series: CRGCQ; Device Class L2: Resistors; RoHS: TRUE; Lead Free: Yes; ComponentLink2Description: Datasheet; Power Rating: 0.25W; Temperature Coefficient: ±100ppm/°C; Value: 1KΩ; Voltage Rating: 200V; Temperature Range High: +155°C; Height: 0.65mm; Category: Res; Resistance: 1KΩ; Composition: Thick Film; Ambient Temperature Range High: +70°C
SW1 = CMP-10040-000033-1: TACT 4.5 X 4.5, 3.8 MM H, 2.5N,; Switch Function: Off-Mom; Switch Travel: 0.25mm; Actuator Type: Standard; Illumination Type: Non-Illuminated; Mechanical Life: 100000Cycles; Ratings: IP40; Operating Force: 250gf; Throw Configuration: SPST; Max Operating Temperature: 70°C; Min Operating Temperature: -20°C; Termination: Gull Wing; Mount: Surface Mount; Packaging: Tape and Reel
Y1 = CMP-40224-000016-1: CRYSTAL 32.7680KHZ 12.5PF SMD; ESR (Equivalent Series Resistance): 70kR; Frequency: 32.768kHz; Frequency Tolerance: 5ppm; Load Capacitance: 12.5pF; Packaging: Tape and Reel; Case/Package: SMD/SMT; Min Operating Temperature: -40°C; Max Operating Temperature: 85°C; Mount: Surface Mount
Y2 = ECS-240-6-37B-7KM-TR: Crystal or Oscillator; Manufacturer_Name: ECS; Datasheet Link: https://ecsxtal.com/store/pdf/ECX-1637B.pdf; Height: 0.5mm; Manufacturer_Part_Number: ECS-240-6-37B-7KM-TR; Mouser Part Number: 520-240-6-37B-7KM-TR; Mouser Price/Stock: https://www.mouser.co.uk/ProductDetail/ECS/ECS-240-6-37B-7KM-TR?qs=B6kkDfuK7%2FDaYBrL7UqWUQ%3D%3D; Arrow Part Number: ECS-240-6-37B-7KM-TR; Arrow Price/Stock: https://www.arrow.com/en/products/ecs-240-6-37b-7km-tr/ecs-international?region=europe

## Sheet COMM.SchDoc
size 594 x 420 mm; SheetNumber: 3; SheetTotal: 4
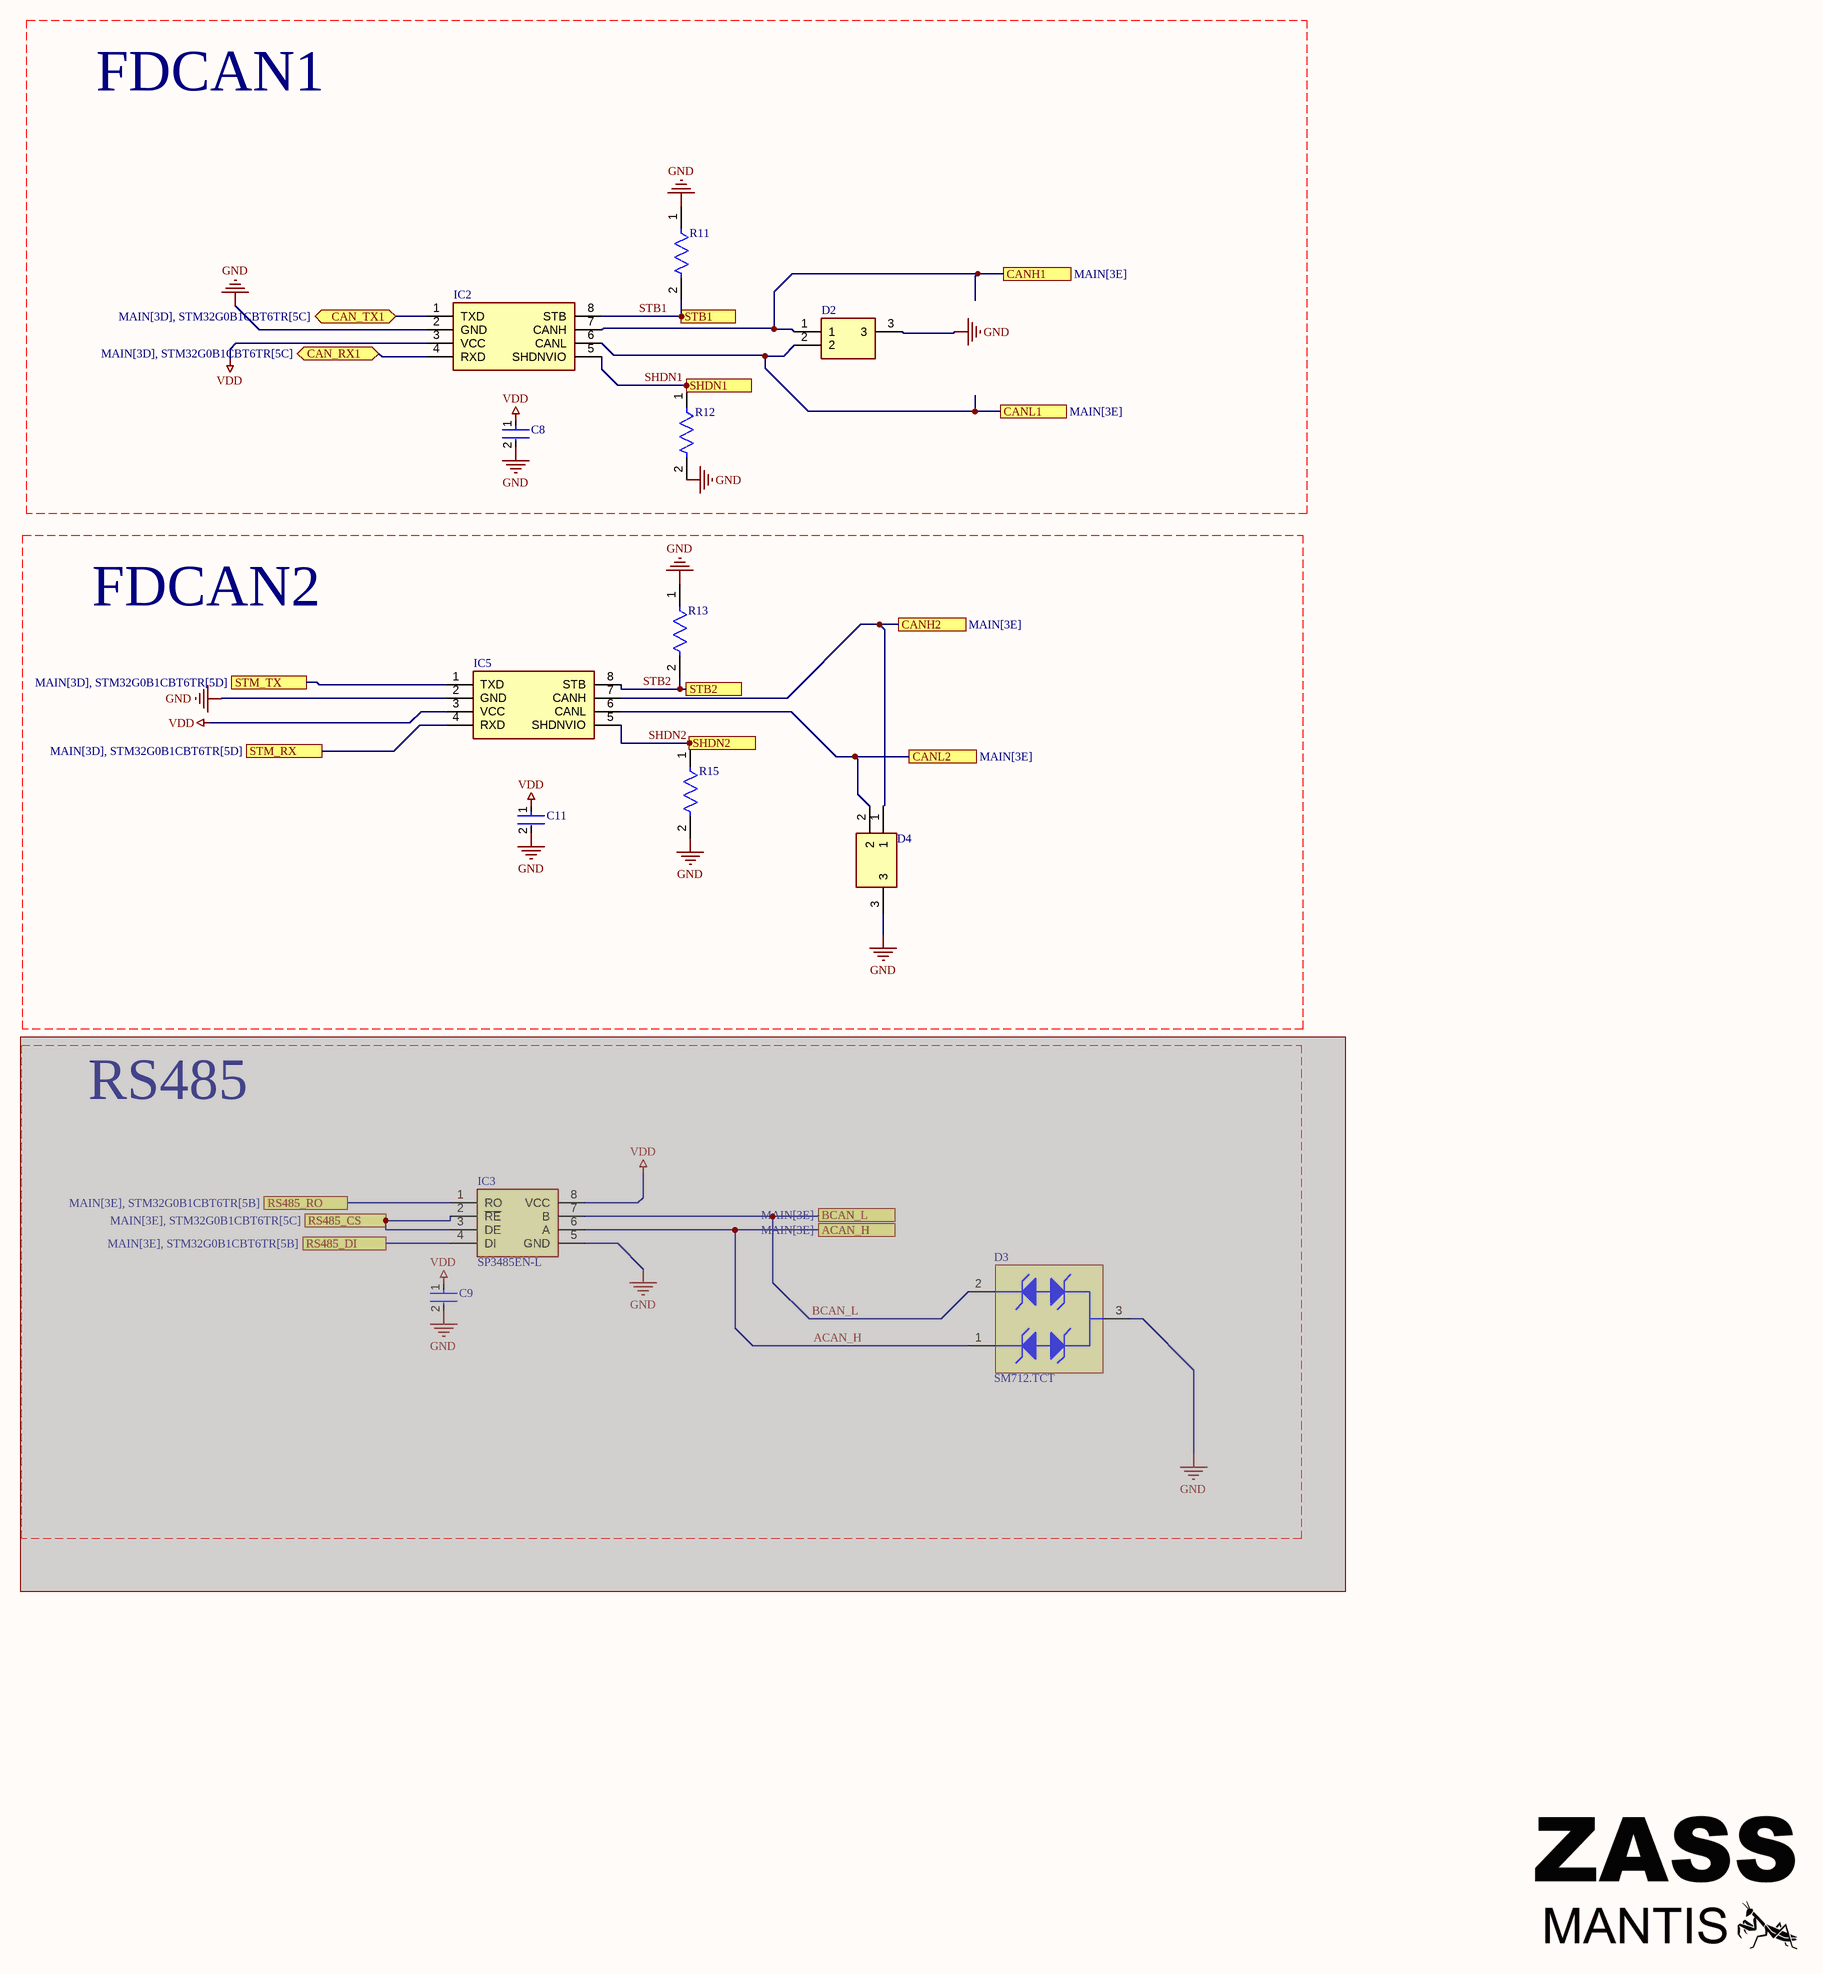
[diagram p3: COMM.SchDoc]

### Parts
(Parts that share a designator on the sheet are numbered #1, #2 ... from top to bottom, then left to right.)
C8  CC0805KRX7R5BB104  [FP-CC0805-EA-MFG]  (value not drawn)
C9#2  CC0805KRX7R5BB104  [FP-CC0805-EA-MFG]  (value not drawn)  (masked out: inside a compile mask, not in the netlist)
C11  CC0805KRX7R5BB104  [FP-CC0805-EA-MFG]  (value not drawn)
D2  ESDCAN06-2BWY  [SOT65P210X110-3N]  (value not drawn)
D3#2  SM712.TCT  [SMTC-SOT23-3_V]  (masked out: inside a compile mask, not in the netlist)
D4  ESDCAN06-2BWY  [SOT65P210X110-3N]  (value not drawn)
IC2  TCAN3414DR  [SOIC127P600X175-8N]  (value not drawn)
IC3  SP3485EN-L  [SOIC127P600X175-8N]  (masked out: inside a compile mask, not in the netlist)
IC5  TCAN3414DR  [SOIC127P600X175-8N]  (value not drawn)
R11  CRGCQ0603J10K  [FP-CRGCQ0603-IPC_C]  (value not drawn)
R12  CRGCQ0603J10K  [FP-CRGCQ0603-IPC_C]  (value not drawn)
R13  CRGCQ0603J10K  [FP-CRGCQ0603-IPC_C]  (value not drawn)
R15  CRGCQ0603J10K  [FP-CRGCQ0603-IPC_C]  (value not drawn)

### Ports
ACAN_H (see MAIN[3E]), BCAN_L (see MAIN[3E]), CAN_RX1 (bidir, see MAIN[3D], STM32G0B1CBT6TR[5C]), CAN_TX1 (bidir, see MAIN[3D], STM32G0B1CBT6TR[5C]), CANH1 (see MAIN[3E]), CANH2 (see MAIN[3E]), CANL1 (see MAIN[3E]), CANL2 (see MAIN[3E]), RS485_CS (see MAIN[3E], STM32G0B1CBT6TR[5C]), RS485_DI (see MAIN[3E], STM32G0B1CBT6TR[5B]), RS485_RO (see MAIN[3E], STM32G0B1CBT6TR[5B]), SHDN1 (see MAIN[2D], STM32G0B1CBT6TR[5C]), SHDN2 (see MAIN[2D], STM32G0B1CBT6TR[5C]), STB1 (see MAIN[2D], STM32G0B1CBT6TR[5C]), STB2 (see MAIN[2D], STM32G0B1CBT6TR[5C]), STM_RX (see MAIN[3D], STM32G0B1CBT6TR[5D]), STM_TX (see MAIN[3D], STM32G0B1CBT6TR[5D])

### Nets
GND: C8.2 C11.2 D2.3 D4.3 IC2.2(GND) IC5.2(GND) R11.1 R12.2 R13.1 R15.2
VDD: C8.1 C11.1 IC2.3(VCC) IC5.3(VCC)
SHDN1: IC2.5(SHDNVIO) R12.1 ; port SHDN1
SHDN2: IC5.5(SHDNVIO) R15.1 ; port SHDN2
STB1: IC2.8(STB) R11.2 ; port STB1
STB2: IC5.8(STB) R13.2 ; port STB2
NetD2_1: D2.1 IC2.7(CANH) ; port CANH1
NetD2_2: D2.2 IC2.6(CANL) ; port CANL1
NetD4_1: D4.1 IC5.7(CANH) ; port CANH2
NetD4_2: D4.2 IC5.6(CANL) ; port CANL2
NetIC1_19: IC5.4(RXD) ; port STM_RX
NetIC1_20: IC5.1(TXD) ; port STM_TX
NetIC1_33: IC2.4(RXD) ; port CAN_RX1
NetIC1_34: IC2.1(TXD) ; port CAN_TX1

### Notes on the sheet
- FDCAN1
- FDCAN2
- RS485
- DWG NO:
- REV:
- THIS DOCUMENT AND THE DATA DISCLOSED HEREIN OR
- HEREWITH IS THE PROPERTY OF ALTIUM LIMITED AND MAY
- BE FREELY DISTRIBUTED IN WHOLE. NO RIGHTS ARE
- RESERVED OR EXPRESS OR IMPLIED WARANTEE GIVEN.
- REVISION
- DESCRIPTION
- DATE
- APPROVED
- PROJECT
- PROJECT REVISION:
- TITLE
- A2
- SIZE
- FILE NAME
- SHEET
- OF

### Library data of the parts
C8 C9#2 C11 = CMP-03422-000810-2: CAP CER X7R 0805; RoHS Compliant: Yes
D2 D4 = ESDCAN06-2BWY: TVS Diode (Bi-directional); Manufacturer_Name: STMicroelectronics; Datasheet Link: https://www.st.com/resource/en/datasheet/esdcan03-2bwy.pdf; Height: 1.1mm; Manufacturer_Part_Number: ESDCAN06-2BWY; Mouser Part Number: 511-ESDCAN06-2BWY; Mouser Price/Stock: https://www.mouser.co.uk/ProductDetail/STMicroelectronics/ESDCAN06-2BWY?qs=u4fy%2FsgLU9P2WkvcJBEfoQ%3D%3D; Arrow Part Number: ESDCAN06-2BWY; Arrow Price/Stock: https://www.arrow.com/en/products/esdcan06-2bwy/stmicroelectronics?utm_currency=USD&region=europe
D3#2 = CMP-2000-05357-1: Asymmetrical TVS Diode for Extended Common-Mode RS-485, 400 W, -55 to 125 degC, 3-Pin SOT23, RoHS, Tape and Reel; Manufacturer: Semtech; Configuration: Dual; Peak Pulse Power Dissipation: 400W; Product Length (mm): 2.9mm; Working Voltage: 12V/7V; Product Height (mm): 0.95mm; Direction Type: Bi-Directional; Product Depth (mm): 1.3mm; Reverse Breakdown Voltage: 13.3V; Reverse Stand-off Voltage: 12V; Leakage Current (Max): 0.02uA; Number of Elements: 2; Peak Pulse Current: 17A; Leakage Current: 1uA/20uA; Rad Hardened: No; Test Current (It): 1mA; Clamping Voltage: 26V/12V; Datasheet URL: https://datasheet.ciiva.com/18065/getdatasheetpartid-110620-18065348.pdf; Operating Temperature Classification: Military; Operating Temperature Min Deg. C: -55C; Manufacturer URL: http://www.semtech.com/; Package Reference: SOT23-3; Operating Temp Range: -55Cto125C; Mounting Style: SurfaceMount; Polarity: Bi-Directional; Pin Count: 3; Package Description: 3-Pin Small Outline Transistor, Body 2.9 x 1.3 mm, Pitch 0.95 mm; Datasheet Version: Nov-04; Mounting: SurfaceMount; Suppressor Type: TVS; Packaging: TapeandReel; Package / Case: SOT-23; Operating Temperature Max Deg. C: 125C
IC2 IC5 = TCAN3414DR: Integrated Circuit; Manufacturer_Name: Texas Instruments; Datasheet Link: https://www.ti.com/lit/ds/symlink/tcan3414.pdf?ts=1713723144569&ref_url=https%253A%252F%252Fwww.mouser.ch%252F; Height: 1.75mm; Manufacturer_Part_Number: TCAN3414DR; Mouser Part Number: 595-TCAN3414DR; Mouser Price/Stock: https://www.mouser.co.uk/ProductDetail/Texas-Instruments/TCAN3414DR?qs=mELouGlnn3egF2AojRJddw%3D%3D; Arrow Part Number: TCAN3414DR; Arrow Price/Stock: https://www.arrow.com/en/products/tcan3414dr/texas-instruments?utm_currency=USD&region=nac
IC3 = SP3485EN-L: Integrated Circuit; Manufacturer_Name: EXAR; Datasheet Link: https://datasheet.datasheetarchive.com/originals/distributors/Datasheets-DGA14/1190127.pdf; Height: 1.75mm; Manufacturer_Part_Number: SP3485EN-L; Mouser Part Number: 701-SP3485EN-L; Mouser Price/Stock: https://www.mouser.com/Search/Refine.aspx?Keyword=701-SP3485EN-L; Arrow Part Number: SP3485EN-L; Arrow Price/Stock: https://www.arrow.com/en/products/sp3485en-l/exar
R11-R13 R15 = CMP-03211-009884-1: as R1 on sheet MAIN; Composition: Thick Film; ComponentLink2URL: https://www.te.com/commerce/DocumentDelivery/DDEController?Action=showdoc&DocId=Data+Sheet%7F1773204-3%7F1%7Fpdf%7FEnglish%7FENG_DS_1773204-3_1.pdf%7F4-2176339-923; Device Class L1: Passive Components; Package: CRGCQ0603; Mouser Description: Res Thick Film 0603 10K Ohm 5% 0.1W(1/10W) ±100ppm/C Pad SMD Automotive T/R; Temperature Range High: +155°C; Category: Res; Device Class L2: Resistors; Height: 0.55mm; RoHS: TRUE; Lead Free: Yes; Ipc Land Pattern Name: RESC16080X45; Temperature: -55°C to +155°C; Series: CRGCQ; Digikey Description: CRGCQ 0603 10K 5%; Octopart: https://octopart.com/crgcq0603j10k-te+connectivity-91018097; Device Class L3: Chip SMD Resistors; Ambient Temperature Range High: +70°C; ComponentLink2Description: Datasheet; Temperature Range Low: -55°C; Manufacturer Part Number: CRGCQ0603J10K

## Nets that join several sheets
GND: MAIN (17 pins), STM32G0B1CBT6TR (15 pins), COMM (10 pins)
VDD: MAIN (12 pins), STM32G0B1CBT6TR (C3.2 C4.2 IC1.5 IC1.6), COMM (C8.1 C11.1 IC2.3 IC5.3)
NetD2_1: MAIN (J3.2 R2.1), COMM (D2.1 IC2.7)
NetD2_2: MAIN (J3.1 R2.2), COMM (D2.2 IC2.6)
NetD4_1: MAIN (J9.2 R27.1), COMM (D4.1 IC5.7)
NetD4_2: MAIN (J9.1 R27.2), COMM (D4.2 IC5.6)
NetIC1_11: MAIN (J6.1 R4.1), STM32G0B1CBT6TR (IC1.11)
NetIC1_12: MAIN (J6.3 R3.1), STM32G0B1CBT6TR (IC1.12)
NetIC1_13: MAIN (J6.5 R1.1), STM32G0B1CBT6TR (IC1.13)
NetIC1_14: MAIN (J7.CD1 R14.1), STM32G0B1CBT6TR (IC1.14)
NetIC1_19: STM32G0B1CBT6TR (IC1.19), COMM (IC5.4)
NetIC1_20: STM32G0B1CBT6TR (IC1.20), COMM (IC5.1)
NetIC1_21: MAIN (R19.1), STM32G0B1CBT6TR (IC1.21)
NetIC1_22: MAIN (P1.1), STM32G0B1CBT6TR (IC1.22)
NetIC1_23: MAIN (P1.2), STM32G0B1CBT6TR (IC1.23)
NetIC1_33: STM32G0B1CBT6TR (IC1.33), COMM (IC2.4)
NetIC1_34: STM32G0B1CBT6TR (IC1.34), COMM (IC2.1)
NetIC1_47: MAIN (J8.2), STM32G0B1CBT6TR (IC1.47)
NetIC1_48: MAIN (J8.3), STM32G0B1CBT6TR (IC1.48)
NRST: MAIN (J2.5), STM32G0B1CBT6TR (C7.2 IC1.10 SW1.3 SW1.4)
SD_CS: MAIN (J7.2 R9.1), STM32G0B1CBT6TR (IC1.15)
SD_MISO: MAIN (J7.7 R6.1), STM32G0B1CBT6TR (IC1.17)
SD_MOSI: MAIN (J7.3 R8.1), STM32G0B1CBT6TR (IC1.18)
SD_SCK: MAIN (J7.5 R7.1), STM32G0B1CBT6TR (IC1.16)
SHDN1: STM32G0B1CBT6TR (IC1.27), COMM (IC2.5 R12.1)
SHDN2: STM32G0B1CBT6TR (IC1.25), COMM (IC5.5 R15.1)
STB1: STM32G0B1CBT6TR (IC1.28), COMM (IC2.8 R11.2)
STB2: STM32G0B1CBT6TR (IC1.26), COMM (IC5.8 R13.2)
SWCLK: MAIN (J2.3), STM32G0B1CBT6TR (IC1.36)
SWDIO: MAIN (J2.4), STM32G0B1CBT6TR (IC1.35)